# EAGLE design v3a (EAGLE 6.5.0)
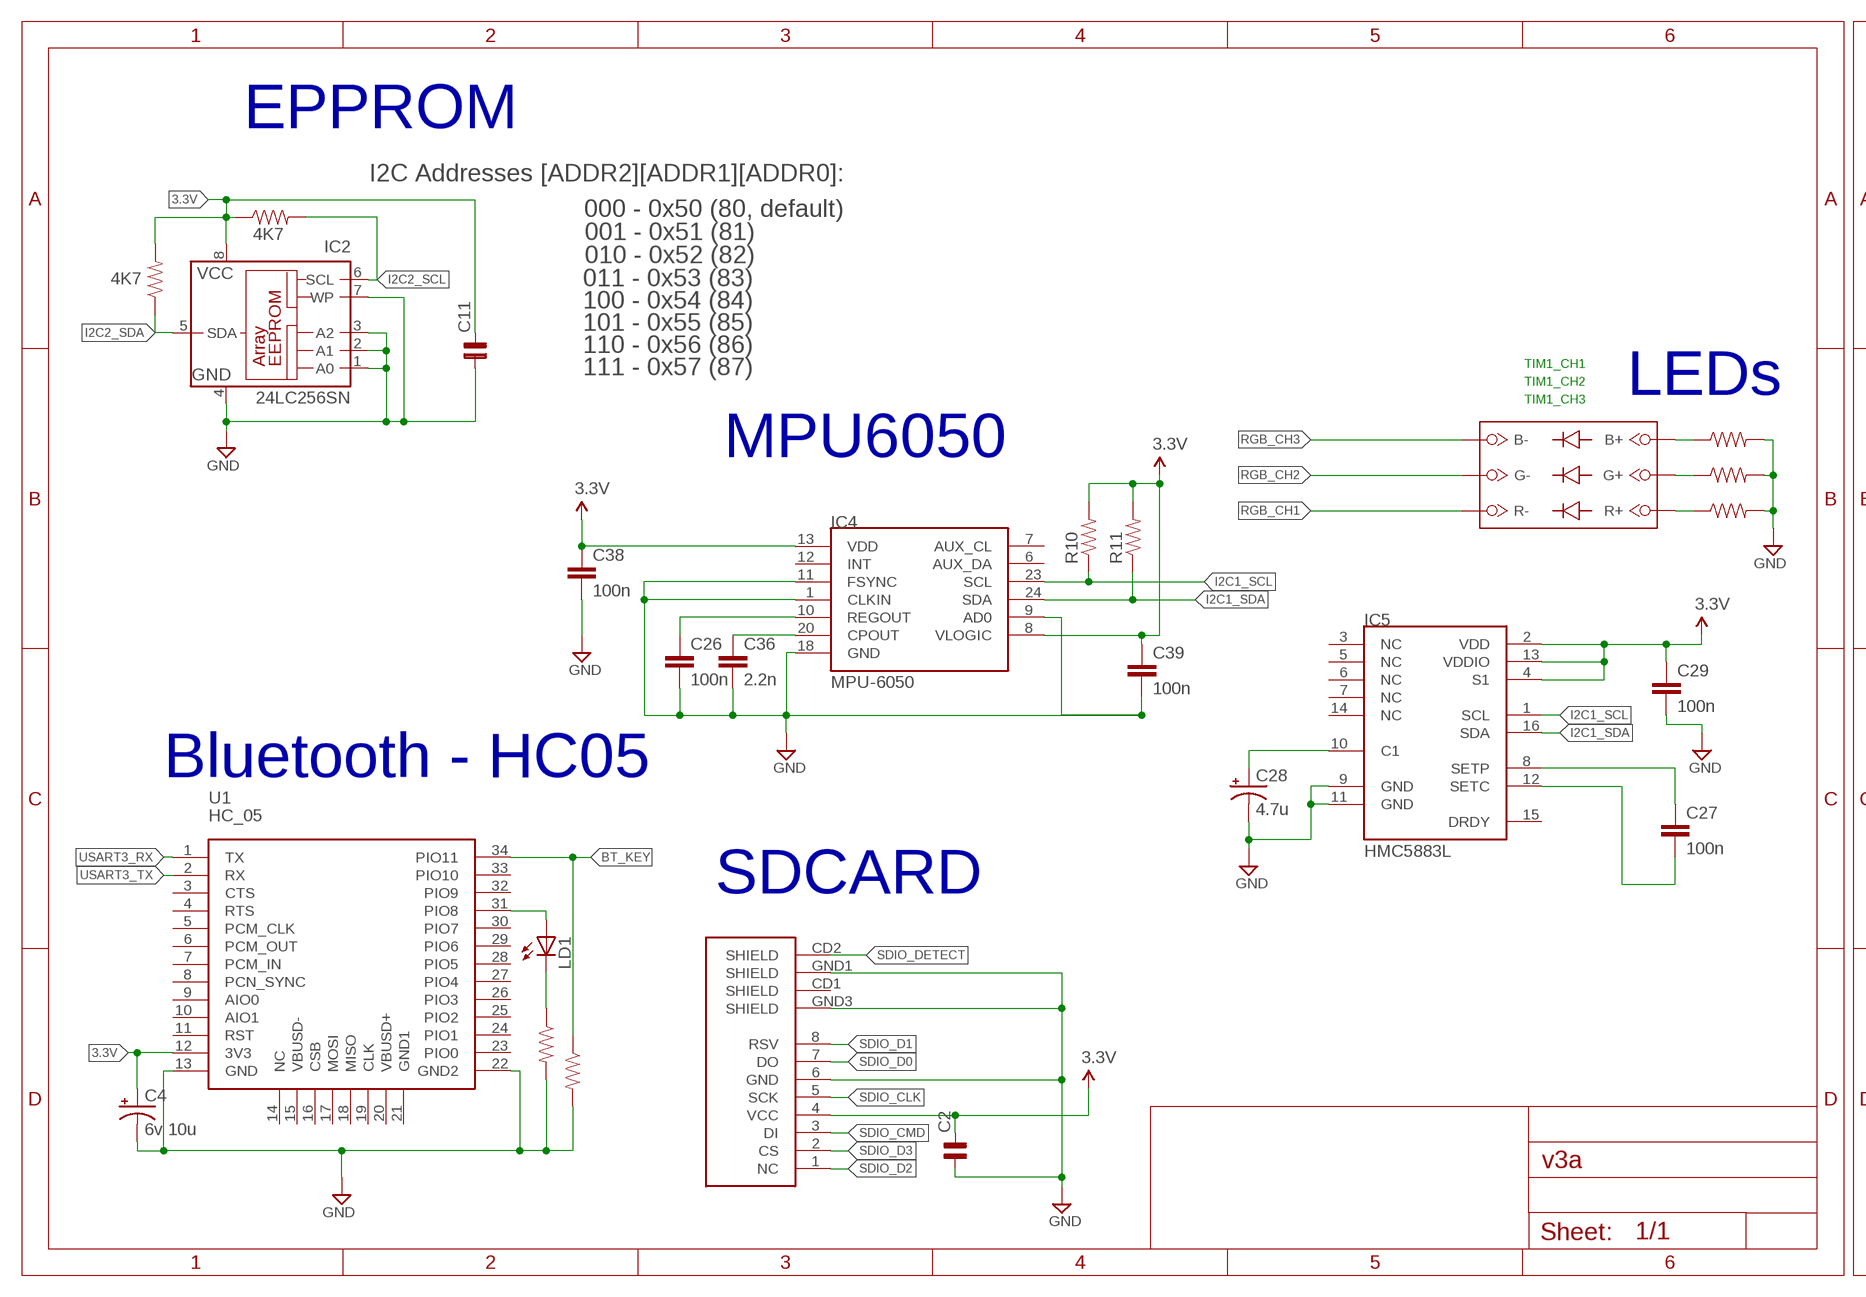
[diagram p0: schematic, sheet 1, part 1 of 2]
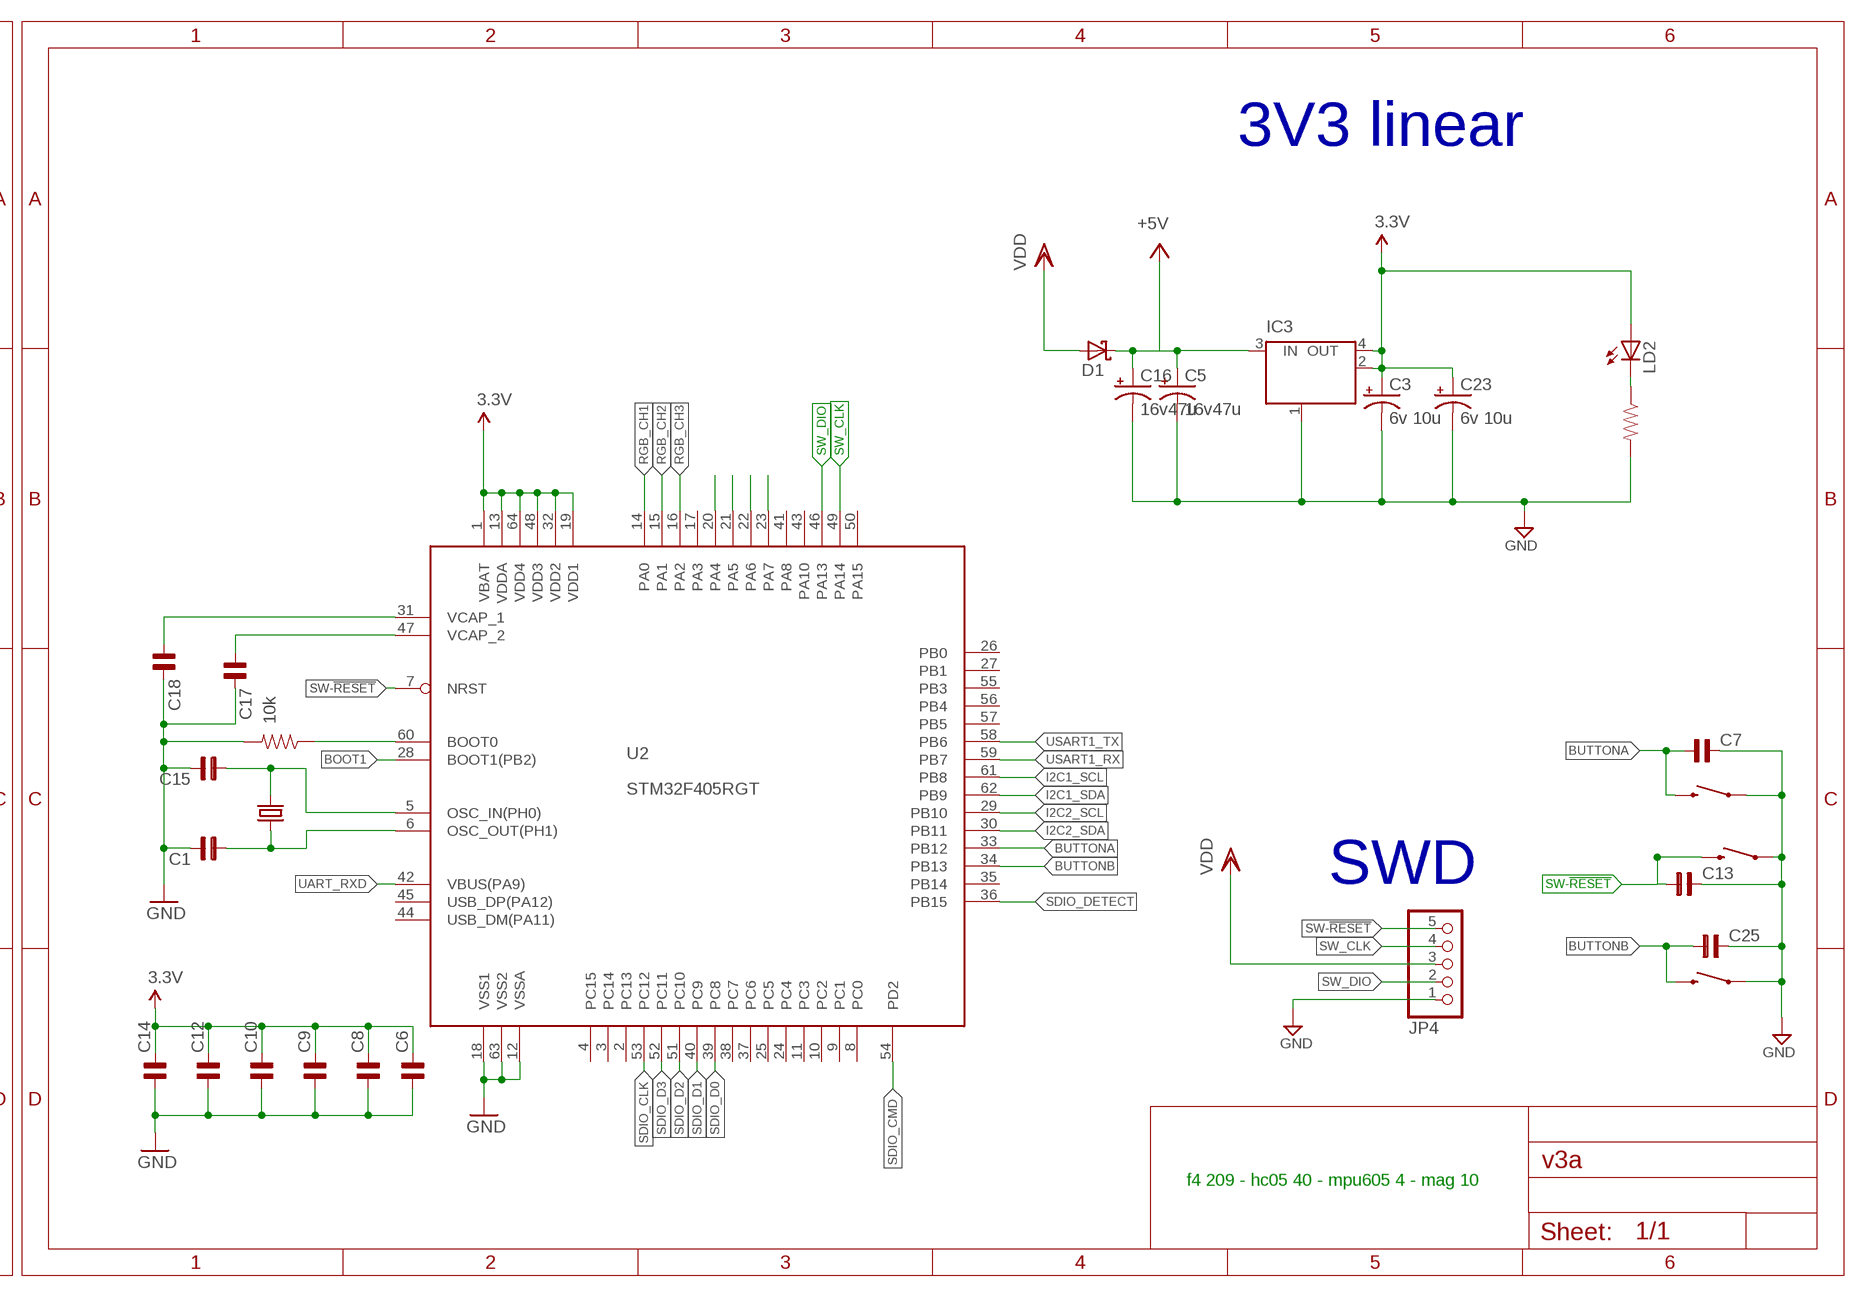
[diagram p1: schematic, sheet 1, part 2 of 2]

## Parts
C1  C-NP-SMD-0603  [C-0603]
C2  C-NP-SMD-0603  [C-0603]
C3  6v 10u  CPOL-USSMCC  [SMC_C]
C4  6v 10u  CPOL-USSMCA  [SMC_A]
C5  16v47u  CPOL-USSMCC  [SMC_C]
C6  C-NP-SMD-0603  [C-0603]
C7  C-NP-SMD-0603  [C-0603]
C8  C-NP-SMD-0603  [C-0603]
C9  C-NP-SMD-0603  [C-0603]
C10  C-NP-SMD-0603  [C-0603]
C11  C-NP-SMD-0603  [C-0603]
C12  C-NP-SMD-0603  [C-0603]
C13  C-NP-SMD-0603  [C-0603]
C14  C-NP-SMD-0603  [C-0603]
C15  C-NP-SMD-0603  [C-0603]
C16  16v47u  CPOL-USSMCC  [SMC_C]
C17  C-NP-SMD-0603  [C-0603]
C18  C-NP-SMD-0603  [C-0603]
C23  6v 10u  CPOL-USSMCC  [SMC_C]
C25  C-NP-SMD-0603  [C-0603]
C26  100n  SPARKFUN_CAP0603-CAP  [SPARKFUN_0603-CAP]
C27  100n  SPARKFUN_CAP0603-CAP  [SPARKFUN_0603-CAP]
C28  4.7u  CPOL-USSMCA  [SMC_A]
C29  100n  SPARKFUN_CAP0603-CAP  [SPARKFUN_0603-CAP]
C36  2.2n  SPARKFUN_CAP0603-CAP  [SPARKFUN_0603-CAP]
C38  100n  SPARKFUN_CAP0603-CAP  [SPARKFUN_0603-CAP]
C39  100n  SPARKFUN_CAP0603-CAP  [SPARKFUN_0603-CAP]
D1  MBRS330T3  [SMC]
IC2  24LC256SN  [SO-08]
IC3  LINEAR_MC33269ST-3.3T3  [LINEAR_SOT223]
IC4  MPU-6050  TESTING_MPU-6050-1  [TESTING_QFN-24-4MM2]
IC5  HMC5883L  SPARKFUN_HMC5883LSMD  [SPARKFUN_16LPCC]
JP4  PINHD-1X5_2.54-90°  [1X05/90]
LD1  LEDCHIPLED_0603  [CHIPLED_0603]
LD2  LEDCHIPLED_0603  [CHIPLED_0603]
R1  10K  SPARKFUN_RESISTOR0603-RES  [SPARKFUN_0603-RES]
R2  10K  SPARKFUN_RESISTOR0603-RES  [SPARKFUN_0603-RES]
R3  10K  SPARKFUN_RESISTOR0603-RES  [SPARKFUN_0603-RES]
R5  10K  SPARKFUN_RESISTOR0603-RES  [SPARKFUN_0603-RES]
R6  10K  SPARKFUN_RESISTOR0603-RES  [SPARKFUN_0603-RES]
R7  10k  SPARKFUN_RESISTOR0603-RES  [SPARKFUN_0603-RES]
R9  10K  SPARKFUN_RESISTOR0603-RES  [SPARKFUN_0603-RES]
R10  SPARKFUN_RESISTOR0603-RES  [SPARKFUN_0603-RES]
R11  SPARKFUN_RESISTOR0603-RES  [SPARKFUN_0603-RES]
R15  4K7  SPARKFUN_RESISTOR0603-RES  [SPARKFUN_0603-RES]
R16  4K7  SPARKFUN_RESISTOR0603-RES  [SPARKFUN_0603-RES]
S1  RESET  SWITCH-MOMENTARY-2-SMD-1101NE  [TACTILE-SWITCH-1101NE]
S2  RESET  SWITCH-MOMENTARY-2-SMD-1101NE  [TACTILE-SWITCH-1101NE]
S4  RESET  SWITCH-MOMENTARY-2-SMD-1101NE  [TACTILE-SWITCH-1101NE]
SDCARD2  microSD Socket  USD-SOCKETNEW  [MICRO-SD-SOCKET-PP]
U1  HC_05  [BLUETOOTH_SMD]
U2  STM32F405RGT  [LQFP64]
U$12  RGB_LED  [SMD]
Y2  CRYSTALHC49US  [HC49US]

## Nets
3.3V: C2.2 C3.+ C4.+ C6.2 C8.2 C9.2 C10.2 C11.2 C12.2 C14.2 C23.+ C29.1 C38.1 C39.1 IC2.8(VCC) IC3.2(OUT) IC3.4(OUT) IC4.8(VLOGIC) IC4.13(VDD) IC5.2(VDD) IC5.4(S1) IC5.13(VDDIO) LD2.A R10.2 R11.2 R15.1 R16.2 SDCARD2.4(VCC) U1.12(3V3) U2.1(VBAT) U2.13(VDDA) U2.19(VDD1) U2.32(VDD2) U2.48(VDD3) U2.64(VDD4)
+5V: C5.+ C16.+ D1.C IC3.3(IN)
BOOT0: R7.1 U2.60(BOOT0)
BOOT1: U2.28(BOOT1(PB2))
BT_KEY: R5.1 U1.34(PIO11)
BUTTONA: C7.1 S4.P$2 U2.33(PB12)
BUTTONB: C25.1 S2.P$2 U2.34(PB13)
GND: C1.2 C2.1 C3.- C4.- C5.- C6.1 C7.2 C8.1 C9.1 C10.1 C11.1 C12.1 C13.2 C14.1 C15.2 C16.- C17.2 C18.2 C23.- C25.2 C26.2 C28.- C29.2 C36.2 C38.2 C39.2 IC2.1(A0) IC2.2(A1) IC2.3(A2) IC2.4(GND) IC2.7(WP) IC3.1(GND/ADJ) IC4.1(CLKIN) IC4.9(AD0) IC4.11(FSYNC) IC4.18(GND) IC5.9(GND) IC5.11(GND) JP4.1 R1.2 R2.2 R3.2 R5.2 R6.2 R7.2 R9.2 S1.P$1 S2.P$1 S4.P$1 SDCARD2.6(GND) SDCARD2.GND1(SHIELD) SDCARD2.GND3(SHIELD) U1.13(GND) U1.22(GND2) U2.12(VSSA) U2.18(VSS1) U2.63(VSS2)
I2C1_SCL: IC4.23(SCL) IC5.1(SCL) R10.1 U2.61(PB8)
I2C1_SDA: IC4.24(SDA) IC5.16(SDA) R11.1 U2.62(PB9)
I2C2_SCL: IC2.6(SCL) R15.2 U2.29(PB10)
I2C2_SDA: IC2.5(SDA) R16.1 U2.30(PB11)
MISO: U2.22(PA6)
MOSI: U2.23(PA7)
N$2: R2.1 U$12.B+
N$3: C26.1 IC4.10(REGOUT)
N$4: LD1.A U1.31(PIO8)
N$5: LD1.C R9.1
N$6: R6.1 U$12.R+
N$7: R3.1 U$12.G+
N$8: C36.1 IC4.20(CPOUT)
N$10: C27.1 IC5.8(SETP)
N$11: LD2.C R1.1
N$12: C28.+ IC5.10(C1)
N$13: C27.2 IC5.12(SETC)
N$14: C15.1 U2.5(OSC_IN(PH0)) Y2.2
N$15: C1.1 U2.6(OSC_OUT(PH1)) Y2.1
N$18: C18.1 U2.31(VCAP_1)
N$19: C17.1 U2.47(VCAP_2)
NSS: U2.20(PA4)
RGB_CH1: U2.14(PA0) U$12.R-
RGB_CH2: U2.15(PA1) U$12.G-
RGB_CH3: U2.16(PA2) U$12.B-
SCK: U2.21(PA5)
SDIO_CLK: SDCARD2.5(SCK) U2.53(PC12)
SDIO_CMD: SDCARD2.3(DI) U2.54(PD2)
SDIO_D0: SDCARD2.7(DO) U2.39(PC8)
SDIO_D1: SDCARD2.8(RSV) U2.40(PC9)
SDIO_D2: SDCARD2.1(NC) U2.51(PC10)
SDIO_D3: SDCARD2.2(CS) U2.52(PC11)
SDIO_DETECT: SDCARD2.CD2(SHIELD) U2.36(PB15)
SW-!RESET: C13.1 JP4.5 S1.P$2 U2.7(NRST)
SW_CLK: JP4.4 U2.49(PA14)
SW_DIO: JP4.2 U2.46(PA13)
UART_RXD: U2.42(VBUS(PA9))
USART1_RX: U2.59(PB7)
USART1_TX: U2.58(PB6)
USART3_RX: U1.1(TX)
USART3_TX: U1.2(RX)
VDD: D1.A JP4.3
Unconnected: IC4.6(AUX_DA) IC4.7(AUX_CL) IC4.12(INT) IC5.3(NC) IC5.5(NC) IC5.6(NC) IC5.7(NC) IC5.14(NC) IC5.15(DRDY) SDCARD2.CD1(SHIELD) U1.3(CTS) U1.4(RTS) U1.5(PCM_CLK) U1.6(PCM_OUT) U1.7(PCM_IN) U1.8(PCN_SYNC) U1.9(AIO0) U1.10(AIO1) U1.11(RST) U1.14(NC) U1.15(VBUSD-) U1.16(CSB) U1.17(MOSI) U1.18(MISO) U1.19(CLK) U1.20(VBUSD+) U1.21(GND1) U1.23(PIO0) U1.24(PIO1) U1.25(PIO2) U1.26(PIO3) U1.27(PIO4) U1.28(PIO5) U1.29(PIO6) U1.30(PIO7) U1.32(PIO9) U1.33(PIO10) U2.2(PC13) U2.3(PC14) U2.4(PC15) U2.8(PC0) U2.9(PC1) U2.10(PC2) U2.11(PC3) U2.17(PA3) U2.24(PC4) U2.25(PC5) U2.26(PB0) U2.27(PB1) U2.35(PB14) U2.37(PC6) U2.38(PC7) U2.41(PA8) U2.43(PA10) U2.44(USB_DM(PA11)) U2.45(USB_DP(PA12)) U2.50(PA15) U2.55(PB3) U2.56(PB4) U2.57(PB5)

## Notes on the sheet
- EPPROM | 3V3 linear
- I2C Addresses [ADDR2][ADDR1][ADDR0]:
- 000 - 0x50 (80, default)
- 001 - 0x51 (81)
- 010 - 0x52 (82)
- 011 - 0x53 (83)
- 100 - 0x54 (84)
- 101 - 0x55 (85)
- 110 - 0x56 (86)
- TIM1_CH1
- 111 - 0x57 (87)
- TIM1_CH2
- LEDs
- TIM1_CH3
- MPU6050
- Bluetooth - HC05
- SDCARD
- SWD
- f4 209 - hc05 40 - mpu605 4 - mag 10
- TJA1040

## Library data of the parts
C1 C2 C6-C15 C17 C18 C25 = cap-pan40:C-NP: NON-POLARIZED FILM/CHIP
C3-C5 C16 C23 C28 = rcl:CPOL-US: POLARIZED CAPACITOR, American symbol
C26 C27 C29 C36 C38 C39 = Helios_RLC:SPARKFUN_CAP: Capacitor Standard 0603 ceramic capacitor, and 0.1" leaded capacitor.
D1 = Robotech Diode of Chung:MBRS3*0T3: SCHOTTKY BARRIER RECTIFIER 3.0 AMPERES 20, 30, 40 VOLT Source: MBRS340T3-D.pdf
IC2 = microchip:24*: Serial EEPROM I2C; DIGIKEY: 24LC256-E/SN-ND; MF: MICROCHIP; MPN: 24LC256-I/SN; OC_FARNELL: 9757996; OC_NEWARK: 27C9144
IC3 = Robotech_Other:LINEAR_MC33269ST*: Adjustable Output Low Dropout Voltage Regulator 800 mA Source: http://www.onsemi.com/pub/Collateral/MC33269-D.PDF
IC4 = Helios_IMU:TESTING_MPU-6050
IC5 = Helios_IMU:SPARKFUN_HMC5883L: 3 Axis Digital Compass IC
JP4 = pinhead-1:PINHD-1X5: PIN HEADER
LD1 LD2 = led:LED: LED OSRAM: - CHIPLED LG R971, LG N971, LY N971, LG Q971, LY Q971, LO R971, LY R971 LH N974, LH R974 LS Q976, LO Q976, LY Q976 LO Q996 - Hyper CHIPLED LW Q18S LB Q993, LB Q99A, LB R99A - SideLED LS A670, LO A670, LY A670, LG A670, LP A670 LB A673, LV A673, LT A673, LW A673 LH A674 LY A675 LS A676, LA A676, LO A676, LY A676, LW A676 LS A679, LY A679, LG A679 - Hyper Micro SIDELED® LS Y876, LA Y876, LO Y876, LY Y876 LT Y87S - SmartLED LW L88C, LW L88S LB L89C, LB L89S, LG L890 LS L89K, LO L89K, LY L89K LS L896, LA L896, LO L896, LY L896 - TOPLED LS T670, LO T670, LY T670, LG T670, LP T670 LSG T670, LSP T670, LSY T670, LOP T670, LYG T670 LG T671, LOG T671, LSG T671 LB T673, LV T673, LT T673, LW T673 LH T674 LS T676, LA T676, LO T676, LY T676, LB T676, LH T676, LSB T676, LW T676 LB T67C, LV T67C, LT T67C, LS T67K, LO T67K, LY T67K, LW E67C LS E67B, LA E67B, LO E67B, LY E67B, LB E67C, LV E67C, LT E67C LW T67C LS T679, LY T679, LG T679 LS T770, LO T770, LY T770, LG T770, LP T770 LB T773, LV T773, LT T773, LW T773 LH T774 LS E675, LA E675, LY E675, LS T675 LS T776, LA T776, LO T776, LY T776, LB T776 LHGB T686 LT T68C, LB T68C - Hyper Mini TOPLED® LB M676 - Mini TOPLED Santana® LG M470 LS M47K, LO M47K, LY M47K Source: http://www.osram.convergy.de/
R1-R3 R5-R7 R9 R15 R16 = Robotech_RCL:SPARKFUN_RESISTOR: Resistor Basic schematic elements and footprints for 0603, 1206, and PTH resistors.
R10 R11 = Helios_RLC:SPARKFUN_RESISTOR: Resistor Basic schematic elements and footprints for 0603, 1206, and PTH resistors.
S1 S2 S4 = pixhawk2:SWITCH-MOMENTARY-2; PARTNO: EVQ-P7J01P
SDCARD2 = SparkFun:USD-SOCKET: microSD Socket Push-push type uSD socket. Schematic element and footprint production proven. Spark Fun Electronics SKU : PRT-00127. tDoc lines correctly indicate media card edge positions when inserting (unlocked, locked, depressed).
U1 = SerialPortBluetooth:HC_05
U2 = m4quad:STM32F405RGT
U$12 = RGB_LED:RGB_LED
Y2 = SparkFun-FreqCtrl:CRYSTAL: Various standard crystals. Proven footprints. Spark Fun Electronics SKU : COM-00534

## Net classes
1 power: width 0.15 mm, drill 0.2 mm, clearance 0.152 mm

## Board
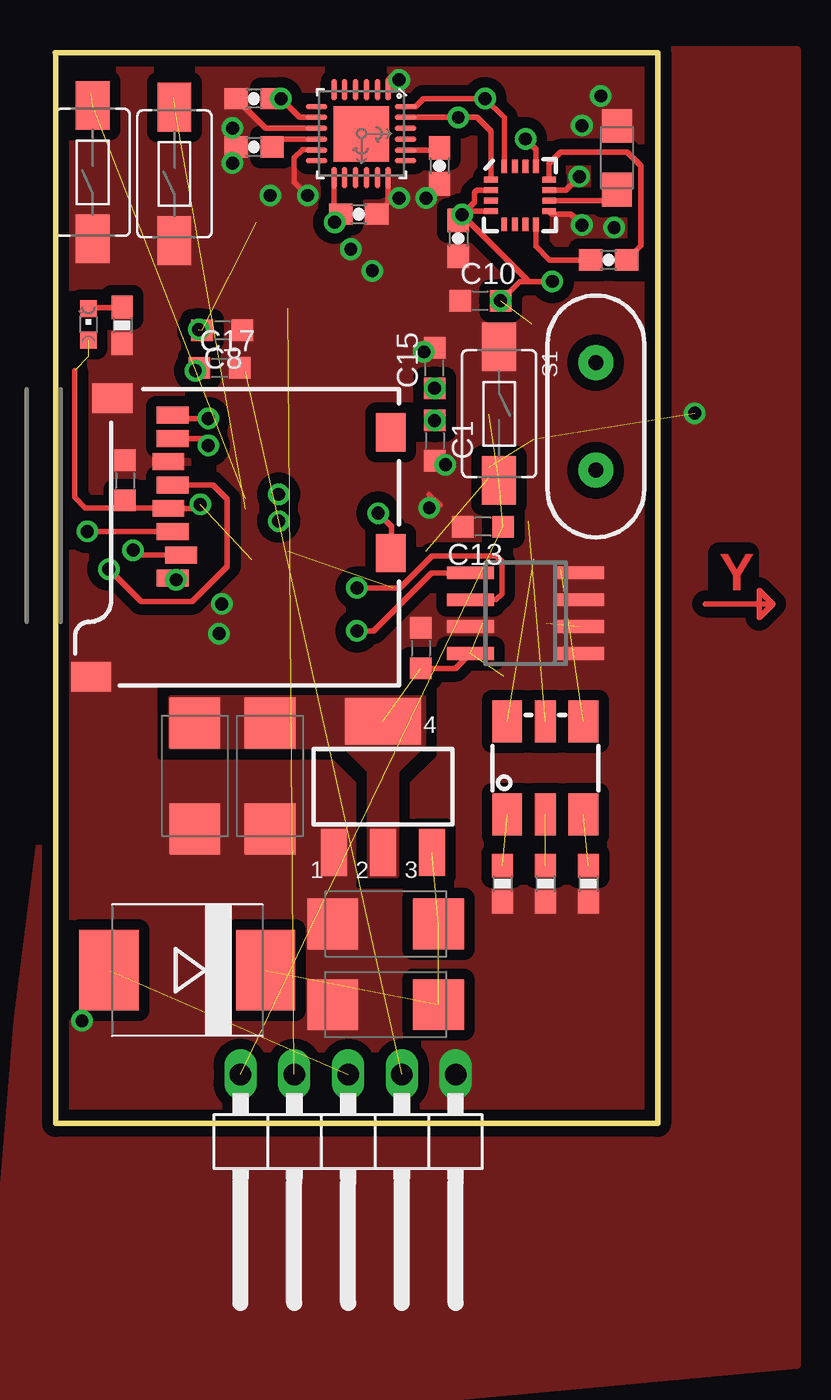
[diagram p2: board, top side]
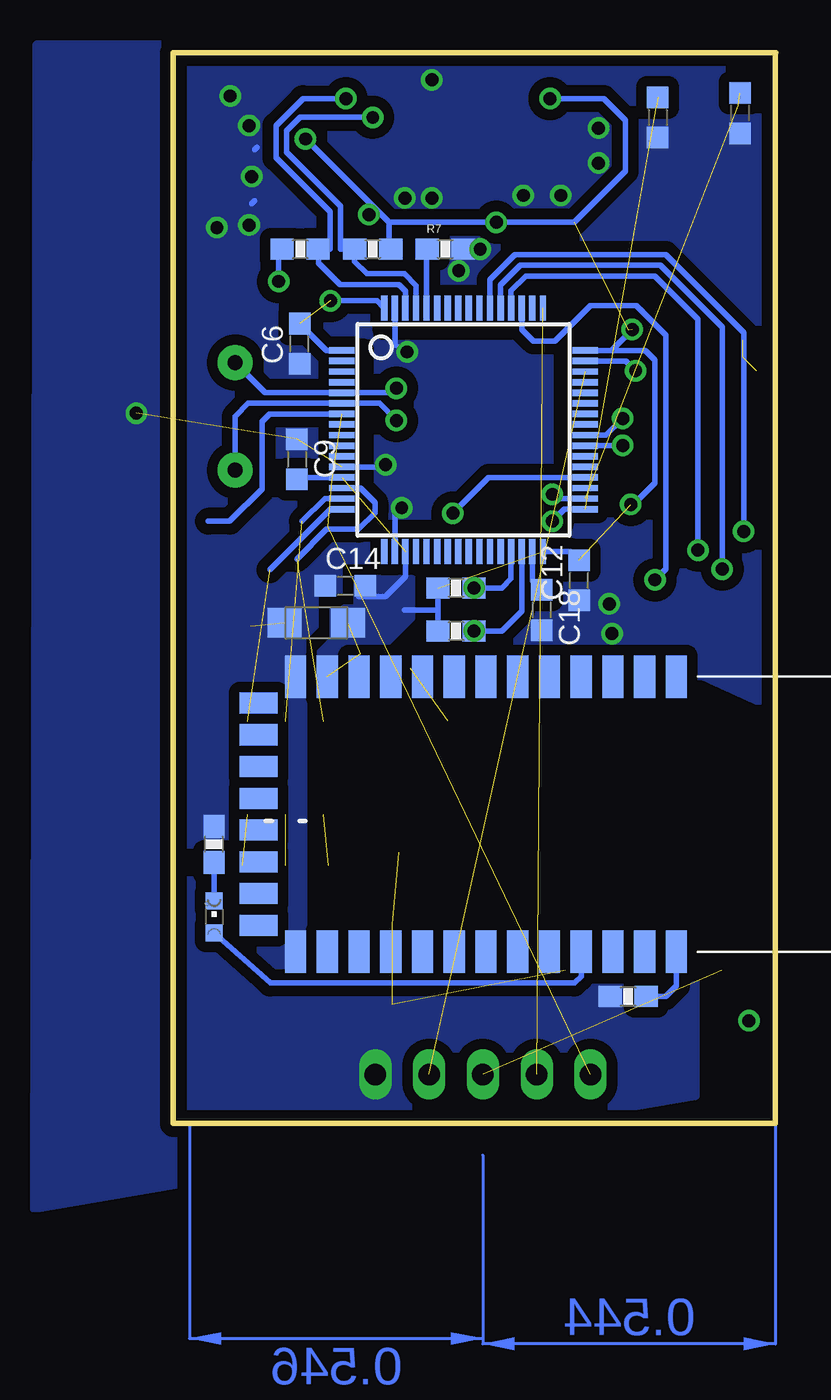
[diagram p3: board, bottom side, seen from below]

Size 28.47 x 50.57 mm. Coordinates in mm from the lower left corner, seen from the top.
Outline: 0,50.57 28.47,50.57 28.47,0 0.03,0 0.03,50.55
Copper layers (1*16): Top 0.035mm / dielectric 1.5mm / Bottom 0.035mm
Design rules "default *": minimum track width 10mil, minimum drill 24mil, track to track 8mil, track to pad 8mil, pad to pad 8mil, via to via 10mil, smd to smd 8mil, copper to edge 20mil, drill to drill 10mil, minimum pad ring 10mil, minimum via ring 8mil, stop-mask expansion 0mil, vias tented up to drill 100mil, thermal gap 10mil
Holes 3.2 mm at -16.33,46.13 -16.33,89.31 -46.05,89.31 -46.05,46.13
Holes 0.61 mm at 52.86,42.8

### Footprints (pad centres in the part's own frame; a part is rotated, then mirrored left to right if it is on the bottom)
C-0603 = smd 1.016 x 1.016: 1 -0.953,0; 2 0.953,0
SMC_C = smd 2.4 x 2.4: + -2.5,0; - 2.5,0
SMC_A = smd 1.6 x 1.4: + -1.5,0; - 1.5,0
SPARKFUN_0603-CAP = smd 1.1 x 1: 1 -0.85,0; 2 0.85,0
SMC = smd 2.8 x 3.8: A 3.7,0; C -3.7,0
SO-08 = smd 0.6 x 2.2: 1 -1.905,-2.6; 2 -0.635,-2.6; 3 0.635,-2.6; 4 1.905,-2.6; 5 1.905,2.6; 6 0.635,2.6; 7 -0.635,2.6; 8 -1.905,2.6
LINEAR_SOT223 = smd 1.219 x 2.235: 1 -2.311,-3.099; 2 0,-3.099; 3 2.311,-3.099 | smd 3.6 x 2.2: 4 0,3.099
TESTING_QFN-24-4MM2 = smd 1.016 x 0.254: 1 -2.066,1.257; 2 -2.066,0.75; 3 -2.066,0.247; 4 -2.066,-0.287; 5 -2.066,-0.792; 6 -2.066,-1.297; 13 2.086,-1.297; 14 2.086,-0.792; 15 2.086,-0.287; 16 2.086,0.247; 17 2.086,0.75; 18 2.086,1.257 | smd 0.254 x 1.016: 7 -1.267,-2.122; 8 -0.762,-2.122; 9 -0.258,-2.122; 10 0.278,-2.122; 11 0.78,-2.122; 12 1.287,-2.122; 19 1.287,2.082; 20 0.78,2.082; 21 0.278,2.082; 22 -0.258,2.082; 23 -0.762,2.082; 24 -1.267,2.082 | smd 2.616 x 2.616: P$1 0.02,-0.01
SPARKFUN_16LPCC = smd 0.65 x 0.28: 1 -1.37,0.75; 2 -1.37,0.25; 3 -1.37,-0.25; 4 -1.37,-0.75; 9 1.37,-0.75; 10 1.37,-0.25; 11 1.37,0.25; 12 1.37,0.75 | smd 0.28 x 0.65: 5 -0.75,-1.37; 6 -0.25,-1.37; 7 0.25,-1.37; 8 0.75,-1.37; 13 0.75,1.37; 14 0.25,1.37; 15 -0.25,1.37; 16 -0.75,1.37
1X05/90 = drill 1.016 long: 1 -5.08,-3.81; 2 -2.54,-3.81; 3 0,-3.81; 4 2.54,-3.81; 5 5.08,-3.81
CHIPLED_0603 = smd 0.8 x 0.8: A 0,-0.75; C 0,0.75
SPARKFUN_0603-RES = smd 1.1 x 1: 1 -0.85,0; 2 0.85,0
TACTILE-SWITCH-1101NE = smd 2.3 x 1.6: P$1 -3.15,0; P$2 3.15,0
MICRO-SD-SOCKET-PP = smd 0.8 x 1.5: 1 -8.94,10.7; 2 -7.84,10.3; 3 -6.74,10.7; 4 -5.64,10.9; 5 -4.54,10.7; 6 -3.44,10.9; 7 -2.34,10.7; 8 -1.24,10.7 | smd 1.8 x 1.4: CD1 -2.05,0.4; CD2 -7.75,0.4 | smd 1.4 x 1.9: GND1 -13.6,14.55; GND3 -0.45,13.55
BLUETOOTH_SMD = smd 2 x 1: 1 0,0; 2 0,-1.5; 3 0,-3; 4 0,-4.5; 5 0,-6; 6 0,-7.5; 7 0,-9; 8 0,-10.5; 9 0,-12; 10 0,-13.5; 11 0,-15; 12 0,-16.5; 13 0,-18; 22 13,-18; 23 13,-16.5; 24 13,-15; 25 13,-13.5; 26 13,-12; 27 13,-10.5; 28 13,-9; 29 13,-7.5; 30 13,-6; 31 13,-4.5; 32 13,-3; 33 13,-1.5; 34 13,0 | smd 1 x 1.8: 14 1.25,-19.75; 15 2.75,-19.75; 16 4.25,-19.75; 17 5.75,-19.75; 18 7.25,-19.75; 19 8.75,-19.75; 20 10.25,-19.75; 21 11.75,-19.75
LQFP64 = smd 0.3 x 1.2: 1 -3.75,-5.75; 2 -3.25,-5.75; 3 -2.75,-5.75; 4 -2.25,-5.75; 5 -1.75,-5.75; 6 -1.25,-5.75; 7 -0.75,-5.75; 8 -0.25,-5.75; 9 0.25,-5.75; 10 0.75,-5.75; 11 1.25,-5.75; 12 1.75,-5.75; 13 2.25,-5.75; 14 2.75,-5.75; 15 3.25,-5.75; 16 3.75,-5.75; 33 3.75,5.75; 34 3.25,5.75; 35 2.75,5.75; 36 2.25,5.75; 37 1.75,5.75; 38 1.25,5.75; 39 0.75,5.75; 40 0.25,5.75; 41 -0.25,5.75; 42 -0.75,5.75; 43 -1.25,5.75; 44 -1.75,5.75; 45 -2.25,5.75; 46 -2.75,5.75; 47 -3.25,5.75; 48 -3.75,5.75 | smd 1.2 x 0.3: 17 5.75,-3.75; 18 5.75,-3.25; 19 5.75,-2.75; 20 5.75,-2.25; 21 5.75,-1.75; 22 5.75,-1.25; 23 5.75,-0.75; 24 5.75,-0.25; 25 5.75,0.25; 26 5.75,0.75; 27 5.75,1.25; 28 5.75,1.75; 29 5.75,2.25; 30 5.75,2.75; 31 5.75,3.25; 32 5.75,3.75; 49 -5.75,3.75; 50 -5.75,3.25; 51 -5.75,2.75; 52 -5.75,2.25; 53 -5.75,1.75; 54 -5.75,1.25; 55 -5.75,0.75; 56 -5.75,0.25; 57 -5.75,-0.25; 58 -5.75,-0.75; 59 -5.75,-1.25; 60 -5.75,-1.75; 61 -5.75,-2.25; 62 -5.75,-2.75; 63 -5.75,-3.25; 64 -5.75,-3.75
SMD = smd 1.99 x 1.4: B+ -2.2,-1.8; B- 2.2,-1.8; R+ -2.2,1.8; R- 2.2,1.8 | smd 1.99 x 1: G+ -2.2,0; G- 2.2,0
HC49US = drill 0.7 pad 1.651: 1 -2.54,0; 2 2.54,0

### Placement (x,y rotation side)
C1  17.93,32.26 270 top
C2  3.3,30.38 270 top
C3  10.16,16.41 270 top
C4  21.72,23.65 180 bottom
C5  15.62,9.42 180 top
C6  22.5,36.83 90 bottom
C7  5.59,47.52 270 bottom
C8  7.9,37.47 180 top
C9  22.63,31.37 270 bottom
C10  20.09,38.86 0 top
C11  17.27,22.45 270 top
C12  9.3,25.65 90 bottom
C13  20.22,28.19 180 top
C14  20.35,25.4 0 bottom
C15  17.93,35.69 90 top
C16  15.62,5.61 180 top
C17  7.77,35.69 0 top
C18  11.07,24.26 270 bottom
C23  6.6,16.41 270 top
C25  1.7,47.73 270 bottom
C26  9.4,46.13 180 top
C27  26.16,40.79 0 top
C28  26.54,45.62 90 top
C29  19.05,41.81 270 top
C36  18.16,45.24 270 top
C38  14.35,42.95 0 top
C39  9.4,48.41 180 top
D1  6.25,7.24 180 top
IC2  22.23,24.1 90 top
IC3  15.49,15.9 0 top
IC4  14.48,46.76 270 top
IC5  21.97,43.84 0 top
JP4  13.84,-1.5 180 top
LD1  26.54,9.75 0 bottom
LD2  1.57,37.74 0 top
R1  3.17,37.69 270 top
R2  25.2,11.33 270 top
R3  23.16,11.33 270 top
R5  6.98,5.99 180 bottom
R6  21.13,11.33 270 top
R7  15.62,41.3 0 bottom
R9  26.54,13.18 90 bottom
R10  19.05,41.3 0 bottom
R11  22.48,41.3 180 bottom
R15  15.11,25.3 0 bottom
R16  15.11,23.27 180 bottom
S1  20.98,33.53 270 top
S2  1.78,44.93 90 top
S4  5.64,44.86 90 top
SDCARD2  16.26,34.7 90 top
U1  4.7,21.11 270 bottom
U2  14.76,32.77 270 bottom
U$12  23.16,16.79 90 top
Y2  25.55,33.4 90 top

### Tracks (layer width: path | path; a pad name or v marks a point on that pad's centre or on a via)
3.3V  (via drill 0.61)  (11 unrouted)
  Top 0.254: IC5.13 22.72,46.01 v22.23,46.51 | C39.1 v10.67,48.41 11.56,47.52 IC4.8 | v19.23,42.94 19.38,43.09 19.43,43.09 | 5.28,29.11 5.33,29.11 | 3.67,29.06 C2.2 3.3,29.08 | 5.33,29.11 5.33,29.08 3.3,29.08 | v19.23,42.94 22.39,39.78 v23.5,39.78 21.96,39.78 C10.2 | IC5.4 19.43,43.09 | IC5.2 19.94,44.09 19.81,43.97 19.81,43.52 v19.23,42.94 | IC4.13 13.18,43.27 C38.1 13.72,43.17 13.72,43.2 13.21,42.7 v13.21,42.57 | C29.1 19.43,43.04 19.43,43.09 | 5.33,29.11 5.36,29.11 SDCARD2.4 | SDCARD2.4 5.23,29.31 5.23,29.21 | C11.2 18.93,21.5 IC2.8 | 9.65,18.91 C3.+ | 0.91,35.56 0.91,29.59 1.43,29.08 3.3,29.08 | SDCARD2.4 6.68,29.06 v6.86,29.24
  Bottom 0.254: v10.67,48.41 8.13,48.41 7.11,47.4 7.11,44.98 9.53,42.57 v13.21,42.57 18.29,42.57 | 23.2,41.17 23.62,41.17 23.5,41.04 v23.5,39.78 | 18.29,42.57 18.29,41.39 R10.2 18.16,41.34 | R11.2 23.2,41.17 | 23.2,41.17 23.07,41.17 | v19.23,42.94 19.23,43.51 | 19.23,43.51 v22.23,46.51 | 18.29,42.57 19.23,43.51 | v6.86,29.24 6.73,29.24 5.72,30.25 5.72,36.07 6.16,36.52 7.77,36.52 | U2.48 7.77,36.52 | 7.77,36.52 v6.79,37.5 | C12.2 9.71,27.02 U2.32 | U2.19 17.51,25.83 18.44,24.89 19.71,24.89 | U2.1 21.24,36.52 C6.2 | U2.13 22.1,30.52 C9.2 | R16.2 R15.1 15.96,24.26 17.55,24.26 | U2.64 18.85,38.86 C10.2
  other vias: 21.04,38.86
  pour Top (isolate 0.508, no thermals): 5.46,17.81 13.72,17.81 14.86,16.66 14.86,11.71 16.13,11.71 16.13,16.66 17.4,17.93 17.4,20.09 5.46,20.09
  pour Bottom (isolate 0.508, no thermals): 20.22,22.73 18.31,22.73 17.17,23.88 17.17,25.78 19.84,25.78 19.84,24.38 20.98,24.38 20.98,22.86 21.59,22.25 21.59,22.12 20.83,22.12
+5V  (3 unrouted)
BOOT0
  Bottom 0.254: R7.1 16.51,41.26 U2.60
BT_KEY
  Bottom 0.254: U1.34 4.7,6.5 5.21,5.99 R5.1
BUTTONA  (via drill 0.61)  (2 unrouted)
  Bottom 0.254: U2.33 10,29.02 v10.57,28.45
BUTTONB  (via drill 0.61)  (2 unrouted)
  Bottom 0.254: U2.34 10.36,29.52 v10.57,29.72
GND  (via drill 0.61)  (3 unrouted)
  Top 0.254: 8.64,48.32 C39.2 9.94,47.02 IC4.9 | IC5.11 24,44.09 24.13,44.09 v24.77,44.73 | 16.16,48.83 IC4.1 15.73,49.29 16.13,49.68 | v24.89,42.44 24.38,42.95 23.48,42.95 IC5.9 | IC4.11 12.34,45.98 12.32,46 11.68,46 11.3,45.62 11.3,44.48 v11.94,43.84 | IC4.18 15.73,43.48 C38.2 | v17.68,29.08 18.19,29.21 17.68,29.72
  Bottom 0.254: 24.64,43.59 24.77,43.46 | 24.64,46 24.51,46.13 | U2.12 18.79,31.02 v18.44,31.12 | U2.18 18.01,28.9 v17.68,29.08 | U2.63 18.01,36.78 v17.42,36.45
  other vias: 24.89,47.14 8.38,47.02 25.78,48.54 16.26,49.3 8.38,45.36 13.97,41.3 30.23,33.55 10.16,43.84 1.27,4.85 26.42,42.32 17.53,43.71 16.26,43.71 7.87,24.54 7.75,23.14 14.99,40.28
  pour Bottom (isolate 0.508, rank 6, no thermals): 3.68,21.23 -8,15.9 -8,50.95 34.93,50.95 35.05,-4.04 3.81,1.3 3.81,8.92 22.35,8.92 22.35,20.22 3.68,20.22
  pour Top (isolate 0.508, rank 6, no thermals): -3.43,-14.96 35.05,-11.4 35.05,50.7 -0.25,50.7 -0.25,16.79 -1.78,4.85
  pour Top (isolate 0.508, rank 6, no thermals): -97.54,34.9 -97.54,65.25 -159.64,65.25 -159.64,29.95 -125.73,29.95 -125.73,34.9
  pour Bottom (isolate 0.508, rank 6, no thermals): -104.78,42.01 -104.78,29.06 -142.62,29.82 -142.62,72.75 -84.84,72.11 -84.84,42.14 -92.46,42.14 -92.46,60.68 -103.76,60.68 -103.76,42.01
I2C1_SCL  (via drill 0.61)
  Top 0.254: IC4.23 | IC5.1 20.6,46.86 19.94,47.52 v19.05,47.52 IC4.23
  Bottom 0.254: v19.05,47.52 22.48,47.52 23.11,46.89 23.11,45.87 20.57,43.33 20.57,41.3 R10.1 19.9,40.7 19.33,40.13 17.55,40.13 17.01,39.59 U2.61
I2C1_SDA  (via drill 0.61)
  Top 0.254: v20.32,48.41 v20.33,48.41 | IC4.24 17.02,48.03 17.4,48.41 v20.32,48.41 | IC5.16 21.22,47.51 v20.32,48.41
  Bottom 0.254: v20.32,48.41 22.35,48.41 23.62,47.14 23.62,45.62 21.07,43.07 21.07,41.3 R11.1 21.62,41.29 21.62,40.64 20.6,39.62 17.81,39.62 17.51,39.33 U2.62
I2C2_SCL  (via drill 0.61)
  Top 0.254: IC2.6 20.83,24.74 21.11,25.02 21.11,26.54 20.85,26.8 17.81,26.8 16.31,25.3 R15.2
  Bottom 0.254: U2.29 12.51,25.75 12.95,25.3 R15.2
  other vias: 14.26,25.3
I2C2_SDA  (via drill 0.61)
  Top 0.254: IC2.5 17.78,26.01 15.04,23.27 R16.1
  Bottom 0.254: U2.30 12.01,24.21 12.95,23.27 13.74,23.27 R16.1
  other vias: 14.26,23.27
N$2  (1 unrouted)
N$3
  Top 0.254: IC4.10 10.61,46.48 C26.1
N$4
  Bottom 0.254: LD1.A 23.89,6.63 9.53,6.63 9.2,6.95 U1.31
N$5
  Bottom 0.254: R9.1 LD1.C
N$6  (1 unrouted)
N$7  (1 unrouted)
N$8
  Top 0.254: IC4.20 18.06,45.98 C36.1
N$10
  Top 0.254: IC5.8 22.72,41.44 23.37,40.79 C27.1
N$11
  Top 0.254: LD2.C 1.62,38.54 R1.1
N$12
  Top 0.254: IC5.10 26.02,43.59 C28.+
N$13
  Top 0.254: IC5.12 23.34,45.34 23.88,45.87 27.05,45.87 27.69,45.24 27.69,41.47 C27.2
N$14  (via drill 0.61)
  Top 0.254: C15.1 17.93,34.54 18.06,34.42 18.06,34.61 C15.1
  Bottom 0.254: Y2.2 24.13,34.52 U2.5 18.15,34.52 C15.1
  other vias: 17.93,34.73
N$15  (via drill 0.61)
  Top 0.254: C1.1 18.25,33.21 18.31,33.15 18,33.15 C1.1
  Bottom 0.254: Y2.1 25.55,33.4 24.94,34.02 U2.6 18.74,34.02 C1.1
  other vias: 17.93,33.21
N$16
  Top 0.254: 33.91,24.54 33.27,25.17 33.27,23.9 33.91,24.54 | 30.73,24.54 33.91,24.54
N$18
  Bottom 0.254: C18.1 11.51,25.64 U2.31
N$19  (via drill 0.61)
  Top 0.254: C17.1 v6.63,35.56
  Bottom 0.254: v6.63,35.56 7.09,36.02 U2.47
RGB_CH1  (1 unrouted)
  Bottom 0.254: U2.14 19.63,30.02 18.95,29.34 18.95,28.83 19.71,28.07 21.23,28.07 22.63,26.67
RGB_CH2  (1 unrouted)
  Bottom 0.254: U2.15 21.31,29.52 22.38,28.45
RGB_CH3  (1 unrouted)
  Bottom 0.254: U2.16 21.05,29.02 23.9,26.16
SDIO_CLK  (via drill 0.61)
  Top 0.254: v2.54,26.19 4.06,24.66 6.48,24.66 8.13,26.31 8.13,29.49 7.46,30.16 SDCARD2.5
  Bottom 0.254: v2.54,26.19 2.54,37.62 5.46,40.54 12.07,40.54 13.01,39.6 U2.53
SDIO_CMD  (via drill 0.61)
  Top 0.254: 5.42,27.96 5.43,27.96 5.43,28.21 SDCARD2.3 5.31,27.96 v1.52,27.96
  Bottom 0.254: v1.52,27.96 1.52,37.36 5.21,41.05 12.32,41.05 13.51,39.86 U2.54
SDIO_D0  (via drill 0.61)
  Top 0.254: SDCARD2.7 6.91,32.36 v7.24,32.03
  Bottom 0.254: U2.39 7.35,32.02 v7.24,32.03
SDIO_D1  (via drill 0.61)
  Top 0.254: SDCARD2.8 5.71,33.3 v7.24,33.3
  Bottom 0.254: U2.40 8.02,32.52 v7.24,33.3
SDIO_D2  (via drill 0.61)
  Top 0.254: 5.65,26.07 5.72,26 v5.72,25.68 5.56,25.84 SDCARD2.1
  Bottom 0.254: v5.72,25.68 5.21,26.19 5.21,37.24 6.6,38.63 8.76,38.63 10.44,36.96 11.46,36.96 12.01,37.51 U2.51
SDIO_D3  (via drill 0.61)
  Top 0.254: SDCARD2.2 3.9,26.86 v3.68,27.08
  Bottom 0.254: v3.68,27.08 3.68,38 5.72,40.03 11.81,40.03 12.51,39.33 U2.52
SDIO_DETECT  (via drill 0.61)
  Top 0.254: SDCARD2.CD2 15.9,26.99 15.9,28.19 v15.27,28.83
  Bottom 0.254: U2.36 13.58,30.52 v15.27,28.83
SW-!RESET  (3 unrouted)
  Bottom 0.254: U2.7 23.91,33.52 24.28,33.15 24.28,29.97 25.81,28.45 26.82,28.45
SW_CLK  (1 unrouted)
SW_DIO  (1 unrouted)
VDD  (1 unrouted)
  pour Top (isolate 0.762, no thermals): 68.2,6.38 68.2,2.31 66.93,2.31 66.93,4.6 65.53,5.99 65.53,6.38
(copper drawn outside any net)
  shapes: Bottom area x2

### Text on the board
Top: Y | X
Bottom: SENSE v2.0
bNames: vnd241092@gmail.com